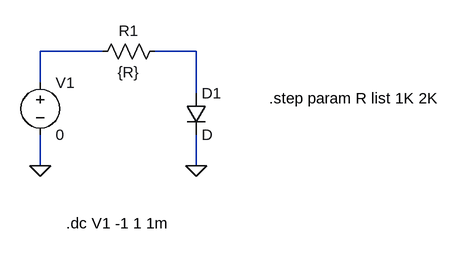
[diagram p0: schematic d.asc]
d.asc, the LTspice schematic file:
Version 4
SHEET 1 2548 1724
WIRE 160 -16 64 -16
WIRE 304 -16 240 -16
WIRE 64 32 64 -16
WIRE 304 48 304 -16
WIRE 64 160 64 112
WIRE 304 160 304 112
FLAG 304 160 0
FLAG 64 160 0
SYMBOL voltage 64 16 R0
SYMATTR InstName V1
SYMATTR Value 0
SYMBOL diode 288 48 R0
SYMATTR InstName D1
SYMBOL res 256 -32 R90
WINDOW 0 0 56 VBottom 2
WINDOW 3 32 56 VTop 2
SYMATTR InstName R1
SYMATTR Value {R}
TEXT 104 248 Left 2 !.dc V1 -1 1 1m
TEXT 416 56 Left 2 !.step param R list 1K 2K

The netlist it stands for:
* d.asc
V1 N001 0 0
D1 N002 0 D
R1 N002 N001 {R}
.model D D
.lib standard.dio
.dc V1 -1 1 1m
.step param R list 1K 2K
.backanno
.end